# EAGLE design Stairs_v5 (EAGLE 9.2.0)
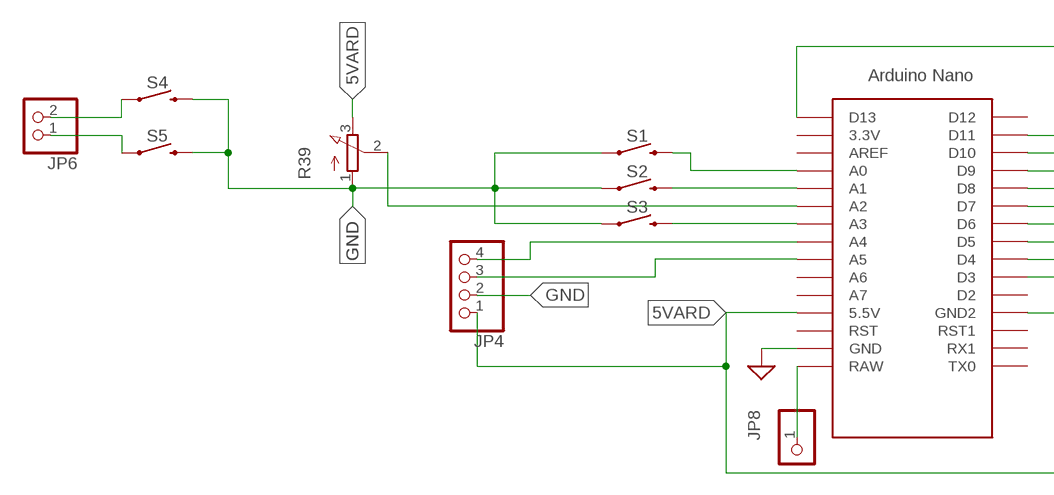
[diagram p0: schematic, sheet 1, part 1 of 2]
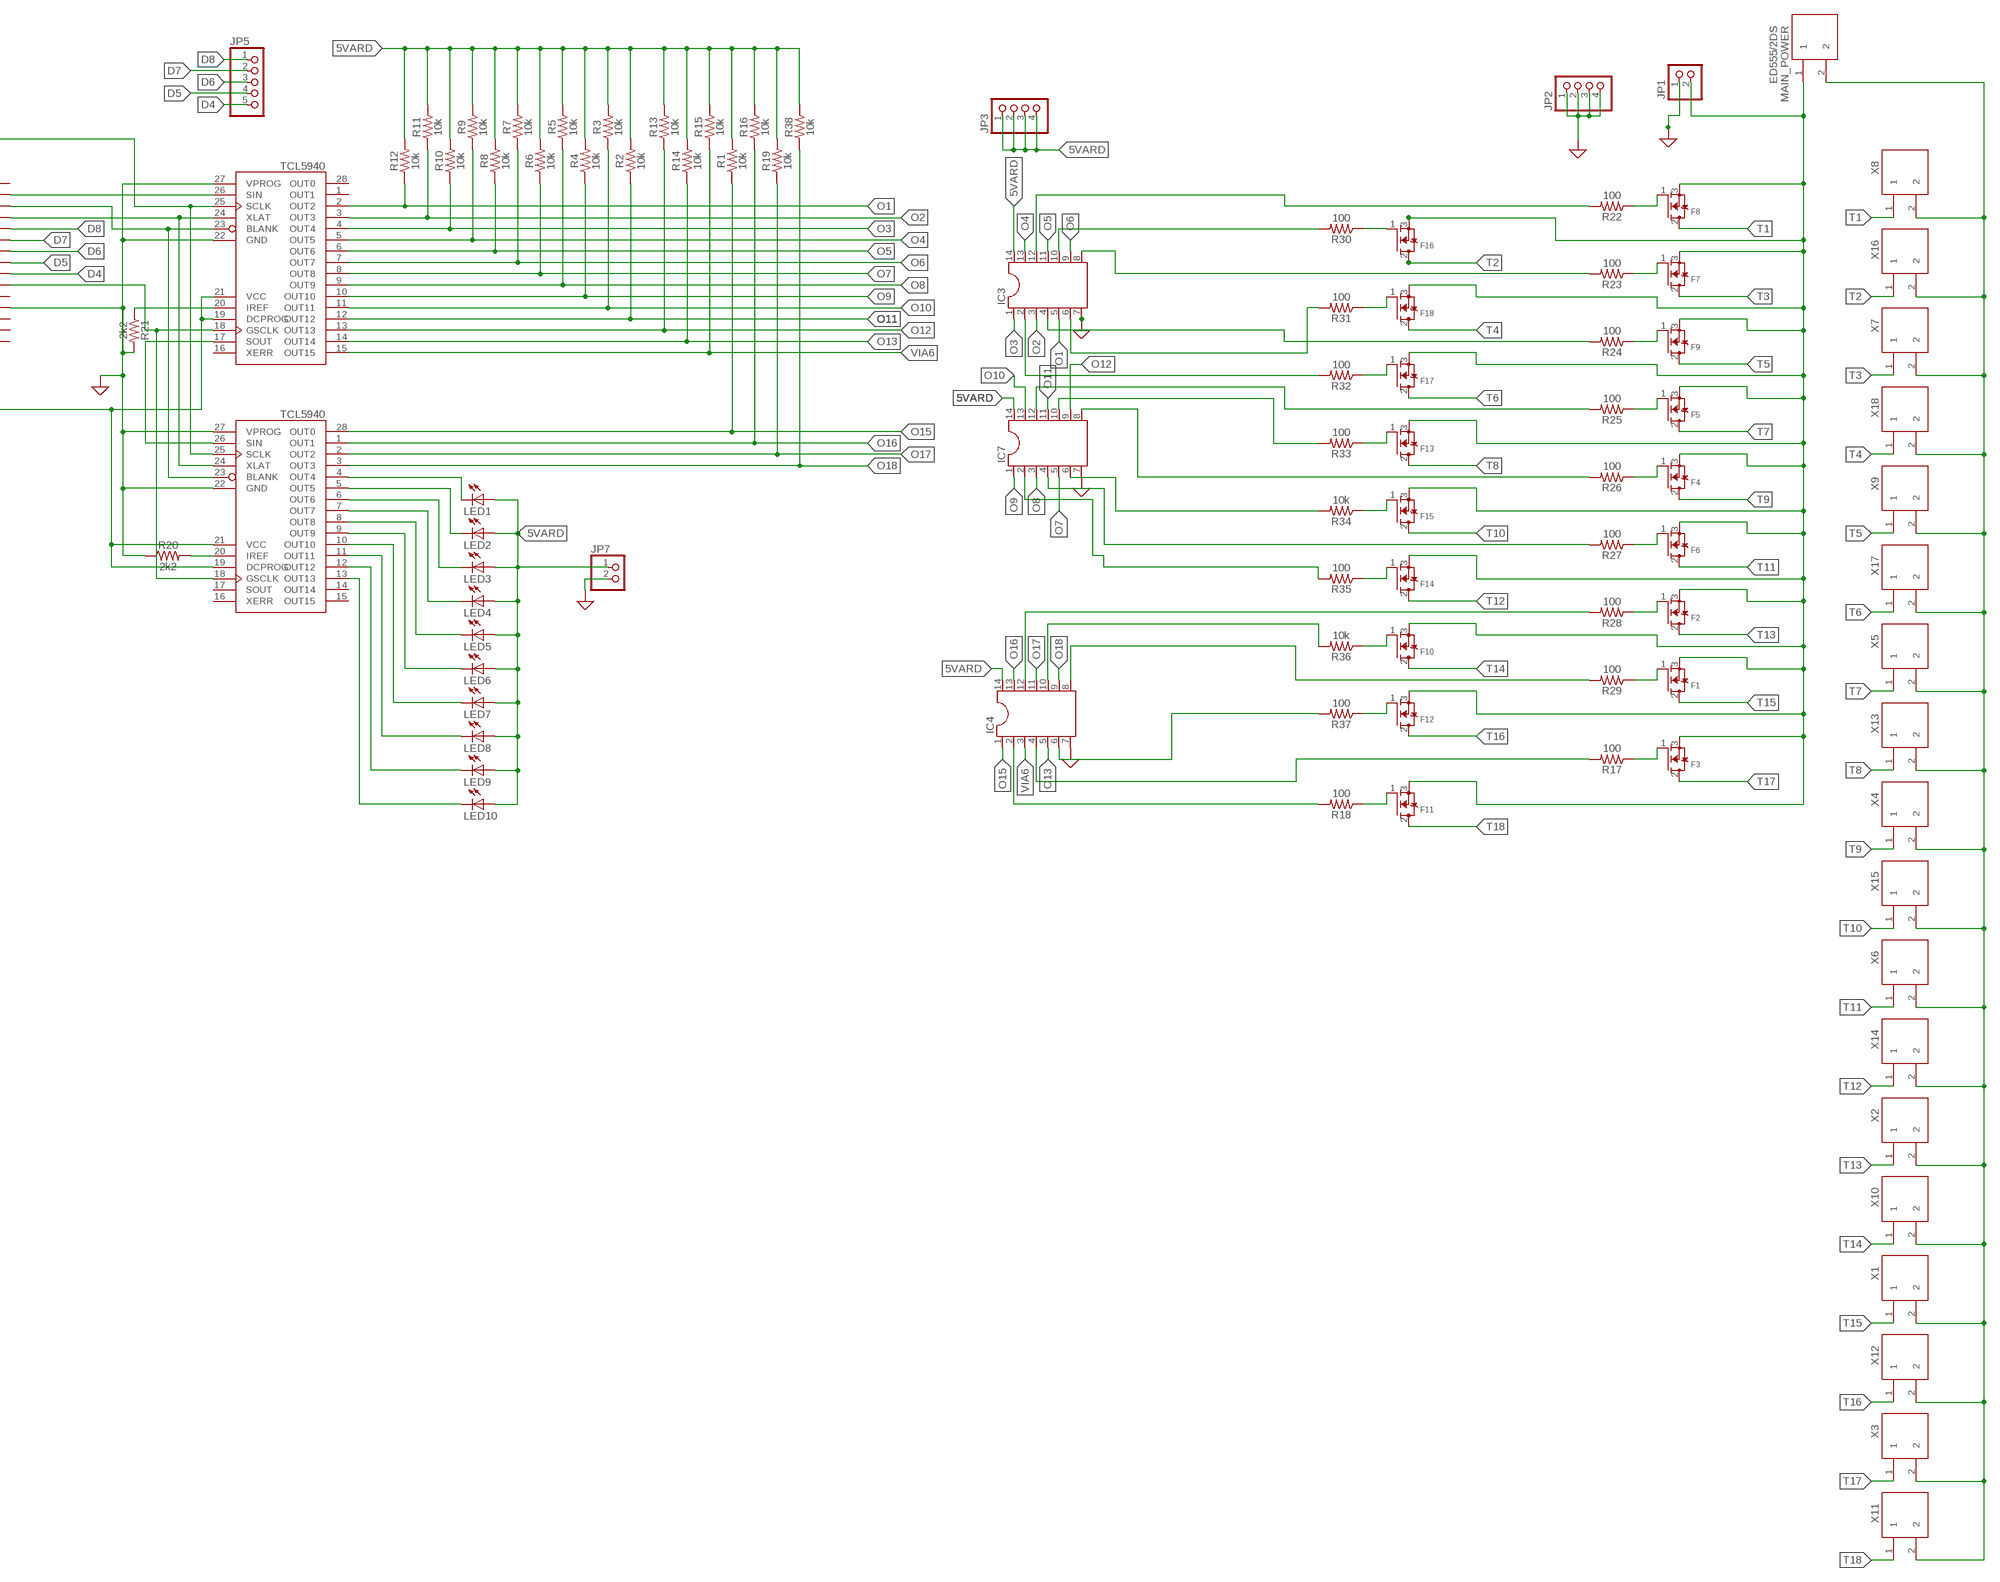
[diagram p1: schematic, sheet 1, part 2 of 2]

## Parts
F1  MOSFET-NGDS_TO220V  [TO220V]
F2  MOSFET-NGDS_TO220V  [TO220V]
F3  MOSFET-NGDS_TO220V  [TO220V]
F4  MOSFET-NGDS_TO220V  [TO220V]
F5  MOSFET-NGDS_TO220V  [TO220V]
F6  MOSFET-NGDS_TO220V  [TO220V]
F7  MOSFET-NGDS_TO220V  [TO220V]
F8  MOSFET-NGDS_TO220V  [TO220V]
F9  MOSFET-NGDS_TO220V  [TO220V]
F10  MOSFET-NGDS_TO220V  [TO220V]
F11  MOSFET-NGDS_TO220V  [TO220V]
F12  MOSFET-NGDS_TO220V  [TO220V]
F13  MOSFET-NGDS_TO220V  [TO220V]
F14  MOSFET-NGDS_TO220V  [TO220V]
F15  MOSFET-NGDS_TO220V  [TO220V]
F16  MOSFET-NGDS_TO220V  [TO220V]
F17  MOSFET-NGDS_TO220V  [TO220V]
F18  MOSFET-NGDS_TO220V  [TO220V]
IC1  TCL5940  [DIP28]
IC2  TCL5940  [DIP28]
IC3  DIL14S  [SOCKET-14]
IC4  DIL14S  [SOCKET-14]
IC7  DIL14S  [SOCKET-14]
JP1  PINHD-1X2  [1X02]
JP2  PINHD-1X4  [1X04]
JP3  PINHD-1X4  [1X04]
JP4  PINHD-1X4  [1X04]
JP5  PINHD-1X5  [1X05]
JP6  PINHD-1X2  [1X02]
JP7  PINHD-1X2  [1X02]
JP8  PINHD-1X1  [1X01]
LED1  LEDSFH482  [SFH482]
LED2  LEDSFH482  [SFH482]
LED3  LEDSFH482  [SFH482]
LED4  LEDSFH482  [SFH482]
LED5  LEDSFH482  [SFH482]
LED6  LEDSFH482  [SFH482]
LED7  LEDSFH482  [SFH482]
LED8  LEDSFH482  [SFH482]
LED9  LEDSFH482  [SFH482]
LED10  LEDSFH482  [SFH482]
MAIN_POWER  ED555/2DS  [ED555/2DS]
R1  10k  10KOHM-HORIZ_KIT-1/4W-1%  [AXIAL-0.3-KIT]
R2  10k  10KOHM-HORIZ_KIT-1/4W-1%  [AXIAL-0.3-KIT]
R3  10k  10KOHM-HORIZ_KIT-1/4W-1%  [AXIAL-0.3-KIT]
R4  10k  10KOHM-HORIZ_KIT-1/4W-1%  [AXIAL-0.3-KIT]
R5  10k  10KOHM-HORIZ_KIT-1/4W-1%  [AXIAL-0.3-KIT]
R6  10k  10KOHM-HORIZ_KIT-1/4W-1%  [AXIAL-0.3-KIT]
R7  10k  10KOHM-HORIZ_KIT-1/4W-1%  [AXIAL-0.3-KIT]
R8  10k  10KOHM-HORIZ_KIT-1/4W-1%  [AXIAL-0.3-KIT]
R9  10k  10KOHM-HORIZ_KIT-1/4W-1%  [AXIAL-0.3-KIT]
R10  10k  10KOHM-HORIZ_KIT-1/4W-1%  [AXIAL-0.3-KIT]
R11  10k  10KOHM-HORIZ_KIT-1/4W-1%  [AXIAL-0.3-KIT]
R12  10k  10KOHM-HORIZ_KIT-1/4W-1%  [AXIAL-0.3-KIT]
R13  10k  10KOHM-HORIZ_KIT-1/4W-1%  [AXIAL-0.3-KIT]
R14  10k  10KOHM-HORIZ_KIT-1/4W-1%  [AXIAL-0.3-KIT]
R15  10k  10KOHM-HORIZ_KIT-1/4W-1%  [AXIAL-0.3-KIT]
R16  10k  10KOHM-HORIZ_KIT-1/4W-1%  [AXIAL-0.3-KIT]
R17  100  10KOHM-HORIZ_KIT-1/4W-1%  [AXIAL-0.3-KIT]
R18  100  10KOHM-HORIZ_KIT-1/4W-1%  [AXIAL-0.3-KIT]
R19  10k  10KOHM-HORIZ_KIT-1/4W-1%  [AXIAL-0.3-KIT]
R20  2k2  10KOHM-HORIZ_KIT-1/4W-1%  [AXIAL-0.3-KIT]
R21  2k2  10KOHM-HORIZ_KIT-1/4W-1%  [AXIAL-0.3-KIT]
R22  100  10KOHM-HORIZ_KIT-1/4W-1%  [AXIAL-0.3-KIT]
R23  100  10KOHM-HORIZ_KIT-1/4W-1%  [AXIAL-0.3-KIT]
R24  100  10KOHM-HORIZ_KIT-1/4W-1%  [AXIAL-0.3-KIT]
R25  100  10KOHM-HORIZ_KIT-1/4W-1%  [AXIAL-0.3-KIT]
R26  100  10KOHM-HORIZ_KIT-1/4W-1%  [AXIAL-0.3-KIT]
R27  100  10KOHM-HORIZ_KIT-1/4W-1%  [AXIAL-0.3-KIT]
R28  100  10KOHM-HORIZ_KIT-1/4W-1%  [AXIAL-0.3-KIT]
R29  100  10KOHM-HORIZ_KIT-1/4W-1%  [AXIAL-0.3-KIT]
R30  100  10KOHM-HORIZ_KIT-1/4W-1%  [AXIAL-0.3-KIT]
R31  100  10KOHM-HORIZ_KIT-1/4W-1%  [AXIAL-0.3-KIT]
R32  100  10KOHM-HORIZ_KIT-1/4W-1%  [AXIAL-0.3-KIT]
R33  100  10KOHM-HORIZ_KIT-1/4W-1%  [AXIAL-0.3-KIT]
R34  10k  10KOHM-HORIZ_KIT-1/4W-1%  [AXIAL-0.3-KIT]
R35  100  10KOHM-HORIZ_KIT-1/4W-1%  [AXIAL-0.3-KIT]
R36  10k  10KOHM-HORIZ_KIT-1/4W-1%  [AXIAL-0.3-KIT]
R37  100  10KOHM-HORIZ_KIT-1/4W-1%  [AXIAL-0.3-KIT]
R38  10k  10KOHM-HORIZ_KIT-1/4W-1%  [AXIAL-0.3-KIT]
R39  3RP/1610N  [3RP/1610N]
S1  MOMENTARY-SWITCH-SPST-PTH-6.0MM  [TACTILE_SWITCH_PTH_6.0MM]
S2  MOMENTARY-SWITCH-SPST-PTH-6.0MM  [TACTILE_SWITCH_PTH_6.0MM]
S3  MOMENTARY-SWITCH-SPST-PTH-6.0MM  [TACTILE_SWITCH_PTH_6.0MM]
S4  MOMENTARY-SWITCH-SPST-PTH-6.0MM  [TACTILE_SWITCH_PTH_6.0MM]
S5  MOMENTARY-SWITCH-SPST-PTH-6.0MM  [TACTILE_SWITCH_PTH_6.0MM]
U$1  NANO  [NANO]
X1  ED555/2DS  [ED555/2DS]
X2  ED555/2DS  [ED555/2DS]
X3  ED555/2DS  [ED555/2DS]
X4  ED555/2DS  [ED555/2DS]
X5  ED555/2DS  [ED555/2DS]
X6  ED555/2DS  [ED555/2DS]
X7  ED555/2DS  [ED555/2DS]
X8  ED555/2DS  [ED555/2DS]
X9  ED555/2DS  [ED555/2DS]
X10  ED555/2DS  [ED555/2DS]
X11  ED555/2DS  [ED555/2DS]
X12  ED555/2DS  [ED555/2DS]
X13  ED555/2DS  [ED555/2DS]
X14  ED555/2DS  [ED555/2DS]
X15  ED555/2DS  [ED555/2DS]
X16  ED555/2DS  [ED555/2DS]
X17  ED555/2DS  [ED555/2DS]
X18  ED555/2DS  [ED555/2DS]

## Nets
5VARD: IC1.19(DCPROG) IC1.21(VCC) IC2.19(DCPROG) IC2.21(VCC) IC3.14 IC4.14 IC7.14 JP3.1 JP3.2 JP3.3 JP3.4 JP4.1 JP7.1 LED1.A LED2.A LED3.A LED4.A LED5.A LED6.A LED7.A LED8.A LED9.A LED10.A R1.P$2 R2.P$2 R3.P$2 R4.P$2 R5.P$2 R6.P$2 R7.P$2 R8.P$2 R9.P$2 R10.P$2 R11.P$2 R12.P$2 R13.P$2 R14.P$2 R15.P$2 R16.P$2 R19.P$2 R38.P$2 R39.3(E) U$1.5V(5.5V)
D4: JP5.5 U$1.D4
D5: JP5.4 U$1.D5
D6: JP5.3 U$1.D6
D7: JP5.2 U$1.D7
D8: JP5.1 U$1.D8
GND: IC1.22(GND) IC1.27(VPROG) IC2.22(GND) IC2.27(VPROG) IC3.7 IC4.7 IC7.7 JP1.1 JP2.1 JP2.2 JP2.3 JP2.4 JP4.2 JP7.2 R20.P$1 R21.P$2 R39.1(A) S1.1 S2.1 S3.1 S4.3 S5.3 U$1.GND U$1.GND1(GND2) ; supply symbol labelled SUP
N$1: IC2.4(OUT4) LED1.K(C)
N$2: JP8.1 U$1.RAW
N$3: IC1.25(SCLK) IC2.25(SCLK) U$1.D13
N$4: IC1.24(XLAT) IC2.24(XLAT) U$1.D9
N$5: IC2.5(OUT5) LED2.K(C)
N$6: JP6.2 S4.1
N$7: S1.3 U$1.A0
N$8: IC1.17(SOUT) IC2.26(SIN)
N$9: IC1.20(IREF) R21.P$1
N$10: IC2.20(IREF) R20.P$2
N$11: F7.1(G) R23.P$1
N$12: IC1.18(GSCLK) IC2.18(GSCLK) U$1.D3
N$13: S2.3 U$1.A1
N$14: R39.2(S) U$1.A2
N$15: F9.1(G) R24.P$1
N$16: S3.3 U$1.A3
N$17: JP4.4 U$1.A4
N$18: F5.1(G) R25.P$1
N$19: JP4.3 U$1.A5
N$21: F4.1(G) R26.P$1
N$22: JP6.1 S5.1
N$23: F8.1(G) R22.P$1
N$24: IC2.6(OUT6) LED3.K(C)
N$25: F6.1(G) R27.P$1
N$26: IC2.7(OUT7) LED4.K(C)
N$27: IC2.8(OUT8) LED5.K(C)
N$28: F2.1(G) R28.P$1
N$29: IC2.9(OUT9) LED6.K(C)
N$30: IC2.10(OUT10) LED7.K(C)
N$31: F1.1(G) R29.P$1
N$32: IC2.11(OUT11) LED8.K(C)
N$33: IC2.12(OUT12) LED9.K(C)
N$34: IC2.13(OUT13) LED10.K(C)
N$35: F16.1(G) R30.P$1
N$38: F18.1(G) R31.P$1
N$41: F17.1(G) R32.P$1
N$44: F13.1(G) R33.P$1
N$47: F15.1(G) R34.P$1
N$50: F14.1(G) R35.P$1
N$53: F10.1(G) R36.P$1
N$56: F12.1(G) R37.P$1
N$59: IC3.12 R22.P$2
N$60: IC3.8 R23.P$2
N$61: IC3.4 R24.P$2
N$79: IC7.10 R33.P$2
N$80: IC3.10 R30.P$2
N$81: IC3.6 R31.P$2
N$82: IC3.2 R32.P$2
N$83: IC7.12 R25.P$2
N$84: IC7.8 R26.P$2
N$85: IC7.4 R27.P$2
N$86: IC4.12 R28.P$2
N$87: IC4.8 R29.P$2
N$88: IC7.6 R34.P$2
N$89: IC4.10 R36.P$2
N$90: IC7.2 R35.P$2
N$91: IC4.6 R37.P$2
N$92: F3.1(G) R17.P$1
N$95: IC4.4 R17.P$2
N$96: F11.1(G) R18.P$1
N$99: IC4.2 R18.P$2
O1: IC1.2(OUT2) IC3.5 R12.P$1
O2: IC1.3(OUT3) IC3.3 R11.P$1
O3: IC1.4(OUT4) IC3.1 R10.P$1
O4: IC1.5(OUT5) IC3.13 R9.P$1
O5: IC1.6(OUT6) IC3.11 R8.P$1
O6: IC1.7(OUT7) IC3.9 R7.P$1
O7: IC1.8(OUT8) IC7.5 R6.P$1
O8: IC1.9(OUT9) IC7.3 R5.P$1
O9: IC1.10(OUT10) IC7.1 R4.P$1
O10: IC1.11(OUT11) IC7.13 R3.P$1
O11: IC1.12(OUT12) IC7.11 R2.P$1
O12: IC1.13(OUT13) IC7.9 R13.P$1
O13: IC1.14(OUT14) IC4.5 R14.P$1
O15: IC2.28(OUT0) IC4.1 R1.P$1
O16: IC2.1(OUT1) IC4.13 R16.P$1
O17: IC2.2(OUT2) IC4.11 R19.P$1
O18: IC2.3(OUT3) IC4.9 R38.P$1
POWER+: MAIN_POWER.2 X1.2 X2.2 X3.2 X4.2 X5.2 X6.2 X7.2 X8.2 X9.2 X10.2 X11.2 X12.2 X13.2 X14.2 X15.2 X16.2 X17.2 X18.2
POWER-: F1.3(S) F2.3(S) F3.3(S) F4.3(S) F5.3(S) F6.3(S) F7.3(S) F8.3(S) F9.3(S) F10.3(S) F11.3(S) F12.3(S) F13.3(S) F14.3(S) F15.3(S) F16.3(S) F17.3(S) F18.3(S) JP1.2 MAIN_POWER.1
T1: F8.2(D) X8.1
T2: F16.2(D) X16.1
T3: F7.2(D) X7.1
T4: F18.2(D) X18.1
T5: F9.2(D) X9.1
T6: F17.2(D) X17.1
T7: F5.2(D) X5.1
T8: F13.2(D) X13.1
T9: F4.2(D) X4.1
T10: F15.2(D) X15.1
T11: F6.2(D) X6.1
T12: F14.2(D) X14.1
T13: F2.2(D) X2.1
T14: F10.2(D) X10.1
T15: F1.2(D) X1.1
T16: F12.2(D) X12.1
T17: F3.2(D) X3.1
T18: F11.2(D) X11.1
VIA4: IC1.26(SIN) U$1.D11
VIA6: IC1.15(OUT15) IC4.3 R15.P$1
VIAXX: IC1.23(BLANK) IC2.23(BLANK) U$1.D10
Unconnected: IC1.1(OUT1) IC1.16(XERR) IC1.28(OUT0) IC2.14(OUT14) IC2.15(OUT15) IC2.16(XERR) IC2.17(SOUT) U$1.3.3V U$1.A6 U$1.A7 U$1.AREF U$1.D2 U$1.D12 U$1.ICSP1 U$1.ICSP2 U$1.ICSP3 U$1.ICSP4 U$1.ICSP5 U$1.ICSP6 U$1.RST U$1.RST1 U$1.RX1 U$1.TX0

## Library data of the parts
F1-F18 = adafruit:MOSFET-N: N-Channel Mosfet 2N7002E - 60V 260mA SOT23 [Digikey: 2N7002ET1GOSTR-ND] - REEL BSH103 - 30V 850mA SOT23 [Digikey: 568-5013-1-ND]
IC1 IC2 = tcl5940:TCL5940: 16-Channel 12-Bit LED Driver
IC3 IC4 IC7 = ic-package:DIL14: Dual In Line / Socket
JP1 JP6 JP7 = pinhead:PINHD-1X2: PIN HEADER
JP2-JP4 = pinhead:PINHD-1X4: PIN HEADER
JP5 = pinhead:PINHD-1X5: PIN HEADER
JP8 = pinhead:PINHD-1X1: PIN HEADER
LED1-LED10 = adafruit:LED: LED OSRAM: - CHIPLED LG R971, LG N971, LY N971, LG Q971, LY Q971, LO R971, LY R971 LH N974, LH R974 LS Q976, LO Q976, LY Q976 LO Q996 - Hyper CHIPLED LW Q18S LB Q993, LB Q99A, LB R99A - SideLED LS A670, LO A670, LY A670, LG A670, LP A670 LB A673, LV A673, LT A673, LW A673 LH A674 LY A675 LS A676, LA A676, LO A676, LY A676, LW A676 LS A679, LY A679, LG A679 - Hyper Micro SIDELED® LS Y876, LA Y876, LO Y876, LY Y876 LT Y87S - SmartLED LW L88C, LW L88S LB L89C, LB L89S, LG L890 LS L89K, LO L89K, LY L89K LS L896, LA L896, LO L896, LY L896 - TOPLED LS T670, LO T670, LY T670, LG T670, LP T670 LSG T670, LSP T670, LSY T670, LOP T670, LYG T670 LG T671, LOG T671, LSG T671 LB T673, LV T673, LT T673, LW T673 LH T674 LS T676, LA T676, LO T676, LY T676, LB T676, LH T676, LSB T676, LW T676 LB T67C, LV T67C, LT T67C, LS T67K, LO T67K, LY T67K, LW E67C LS E67B, LA E67B, LO E67B, LY E67B, LB E67C, LV E67C, LT E67C LW T67C LS T679, LY T679, LG T679 LS T770, LO T770, LY T770, LG T770, LP T770 LB T773, LV T773, LT T773, LW T773 LH T774 LS E675, LA E675, LY E675, LS T675 LS T776, LA T776, LO T776, LY T776, LB T776 LHGB T686 LT T68C, LB T68C - Hyper Mini TOPLED® LB M676 - Mini TOPLED Santana® LG M470 LS M47K, LO M47K, LY M47K Source: http://www.osram.convergy.de/
MAIN_POWER X1-X18 = DC_LOAD_AU:ED555/2DS: 2-Pin Terminal Block 3.5mm pitch 6A
R1-R16 R19 R34 R36 R38 = SparkFun-Resistors:10KOHM: 10kΩ resistor A resistor is a passive two-terminal electrical component that implements electrical resistance as a circuit element. Resistors act to reduce current flow, and, at the same time, act to lower voltage levels within circuits. - Wikipedia; PROD_ID: RES-12183
R17 R18 R20-R33 R35 R37 = SparkFun-Resistors:10KOHM: 10kΩ resistor A resistor is a passive two-terminal electrical component that implements electrical resistance as a circuit element. Resistors act to reduce current flow, and, at the same time, act to lower voltage levels within circuits. - Wikipedia; PROD_ID: RES-12183; VALUE: 10k
R39 = pot:3RP/1610N: 16mm Potentiometer one level Source: http://www.alphapotentiometers.net/html/16mm_pot_2.html
S1-S5 = SparkFun-Switches:MOMENTARY-SWITCH-SPST: Momentary Switch (Pushbutton) - SPST Normally-open (NO) SPST momentary switches (buttons, pushbuttons). Variants PTH-12MM - 12mm square, through-hole Momentary Pushbutton Switch - 12mm Square <https://www.sparkfun.com/products/9190> (COM-09190) PTH-6.0MM, PTH-6.0MM-KIT - 6.0mm square, through-hole Mini Pushbutton Switch <https://www.sparkfun.com/products/97> (COM-00097) KIT package intended for soldering kit's - only one side of pads' copper is exposed. PTH-RIGHT-ANGLE-KIT - Right-angle, through-hole Right Angle Tactile Button <https://www.sparkfun.com/products/10791> - Used on SparkFun BigTime Watch Kit <https://www.sparkfun.com/products/11734> SMD-12MM - 12mm square, surface-mount Tactile Button - SMD (12mm) <https://www.sparkfun.com/products/12993> (COM-12993) Used on SparkFun PicoBoard <https://www.sparkfun.com/products/11888> SMD-4.5MM - 4.5mm Square Trackball Switch Used on SparkFun Blackberry Trackballer Breakout <https://www.sparkfun.com/products/13169> SMD-4.6MMX2.8MM - 4.60mm x 2.80mm, surface mount Used on SparkFun SAMD21 Mini Breakout <https://www.sparkfun.com/products/13664> SMD-5.2MM, SMD-5.2-REDUNDANT - 5.2mm square, surface-mount Mini Pushbutton Switch - SMD <https://www.sparkfun.com/products/8720> (COM-08720) Used on Arduino Pro Mini <https://www.sparkfun.com/products/11114> REDUNDANT package connects both switch circuits together SMD-6.0X3.5MM - 6.0 x 3.5mm, surface mount Momentary Reset Switch SMD <https://www.sparkfun.com/products/8229> (COM-08229) SMD-6.2MM-TALL - 6.2mm square, surface mount Tactile Button - SMD (6mm) <https://www.sparkfun.com/products/12992> Used on SparkFun Digital Sandbox <https://www.sparkfun.com/products/12651> SMD-RIGHT-ANGLE - Right-angle, surface mount Used on SparkFun Block for Intel® Edison - Arduino <https://www.sparkfun.com/products/13036>; PROD_ID: SWCH-08441; SF_SKU: COM-00097
U$1 = Arduino-clone:NANO: Arduino Nano

## Net classes
0 default: width 0.3 mm, clearance 0.5 mm

## Board
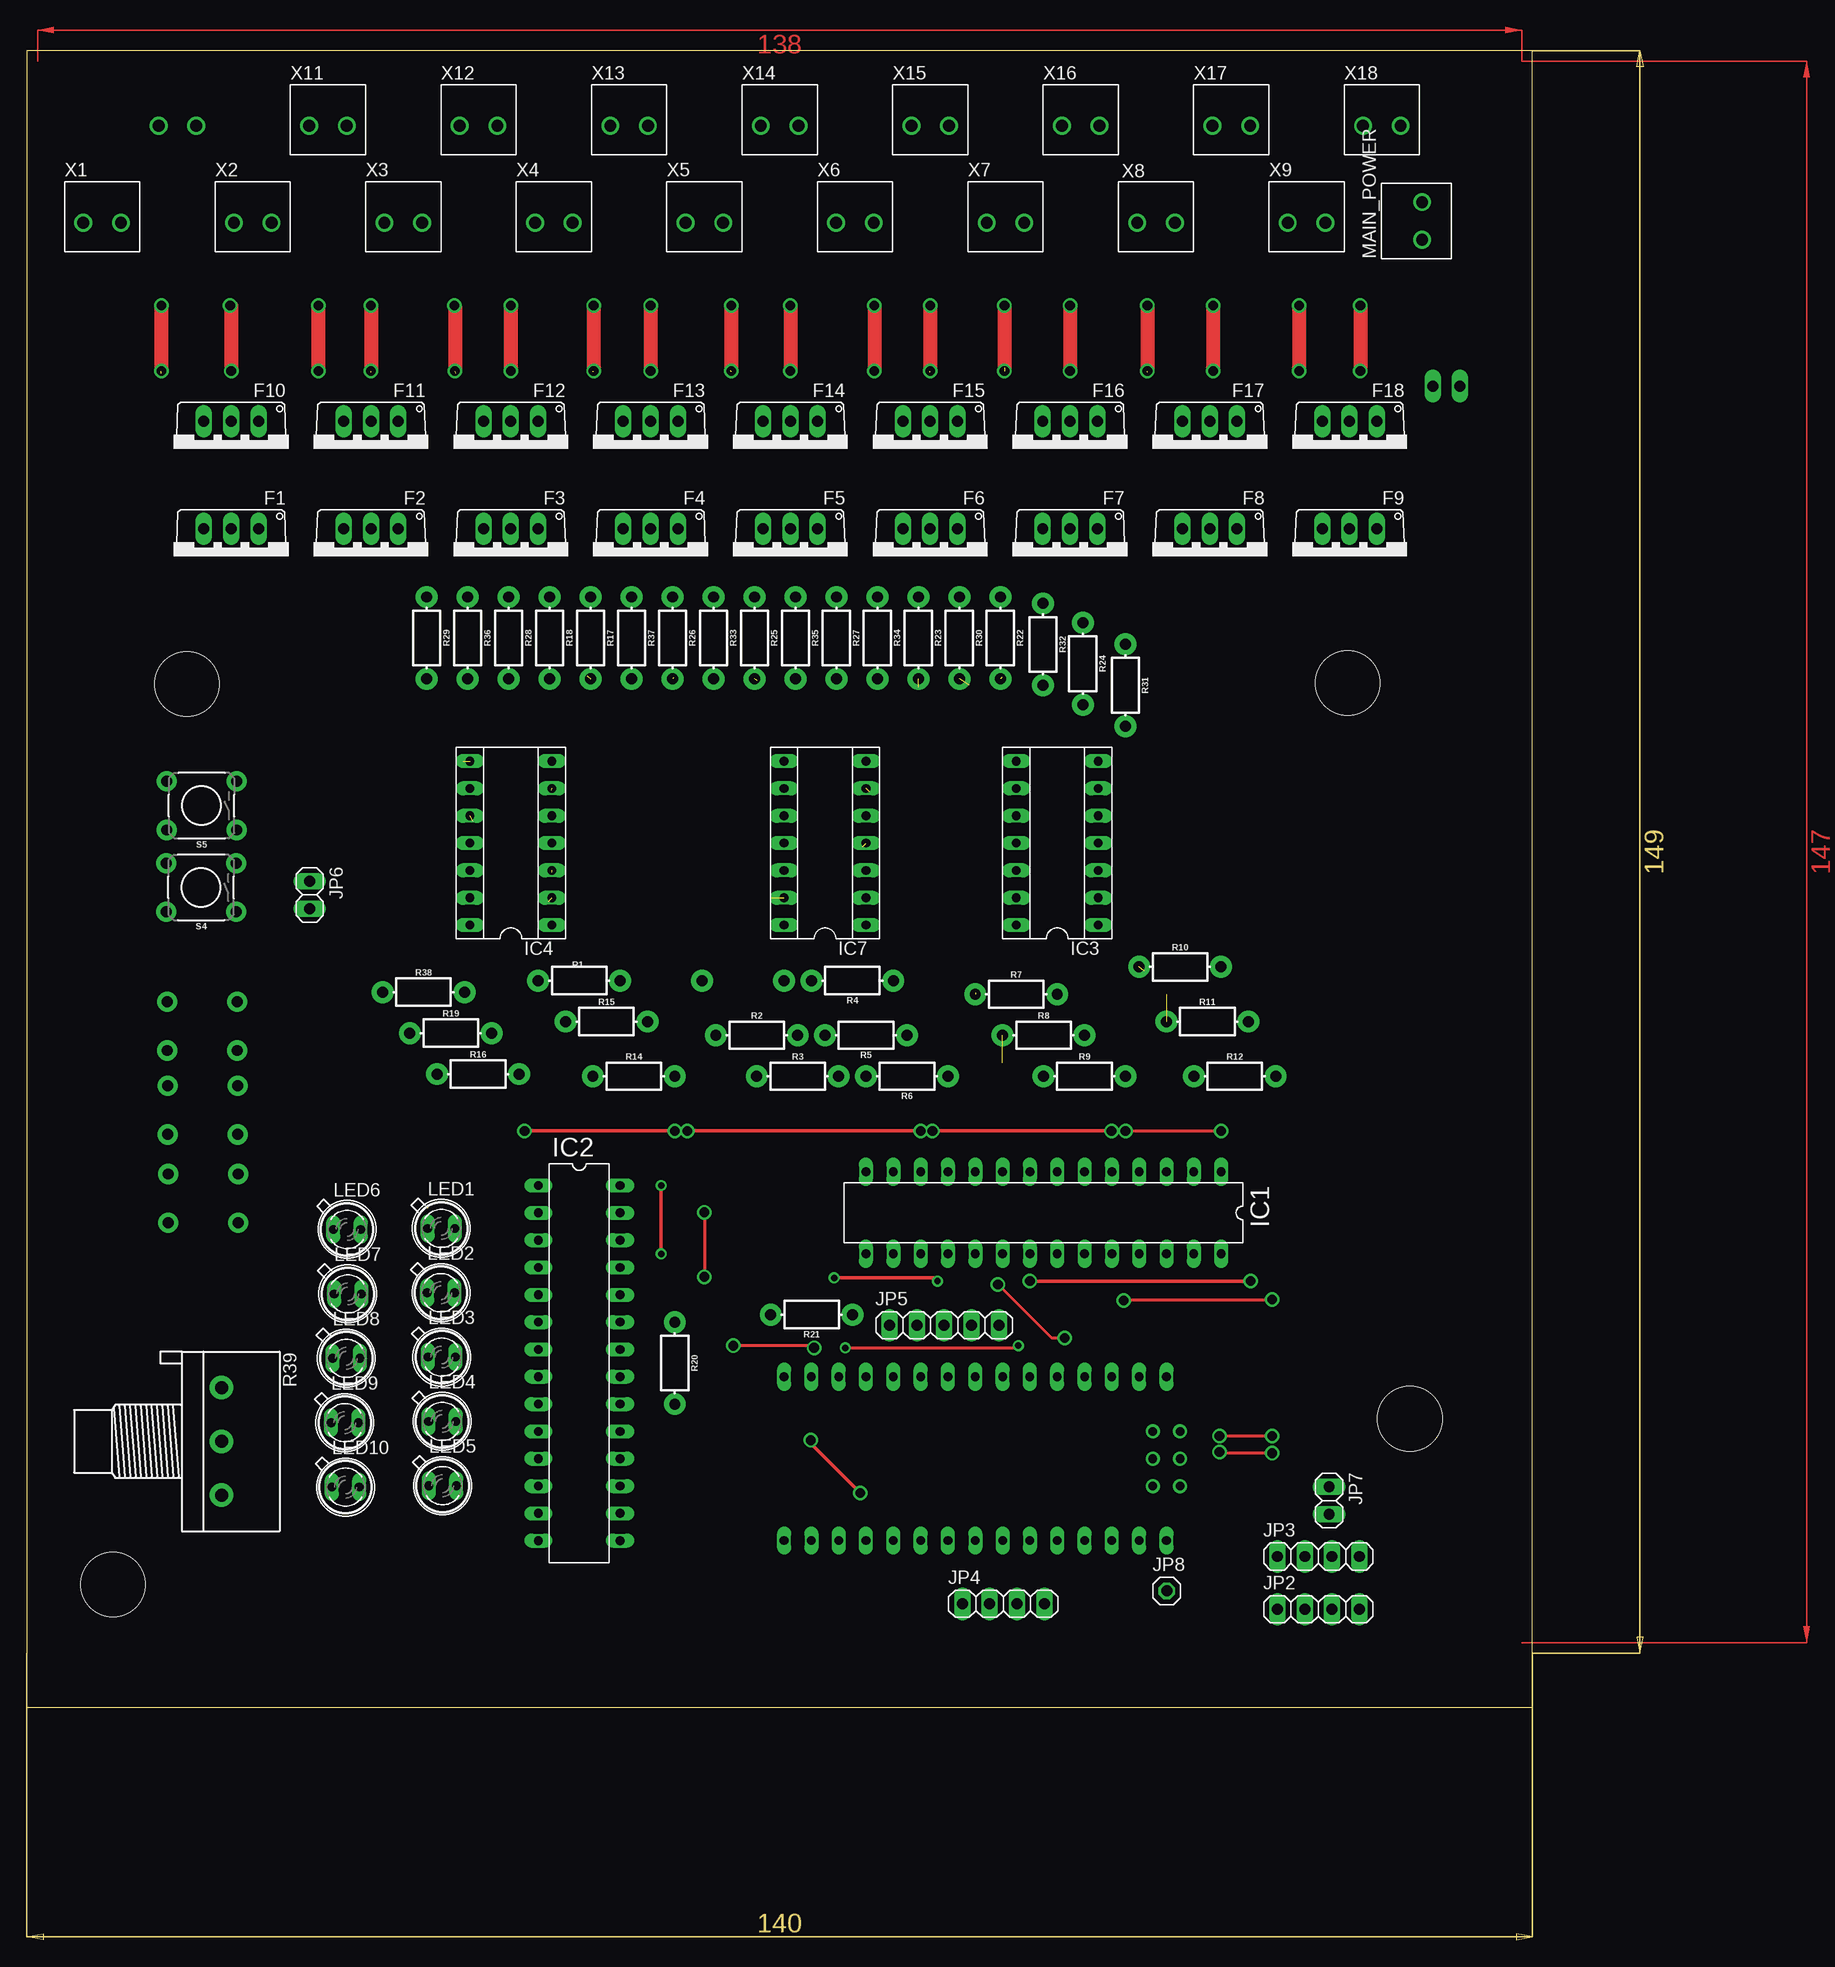
[diagram p2: board, top side]
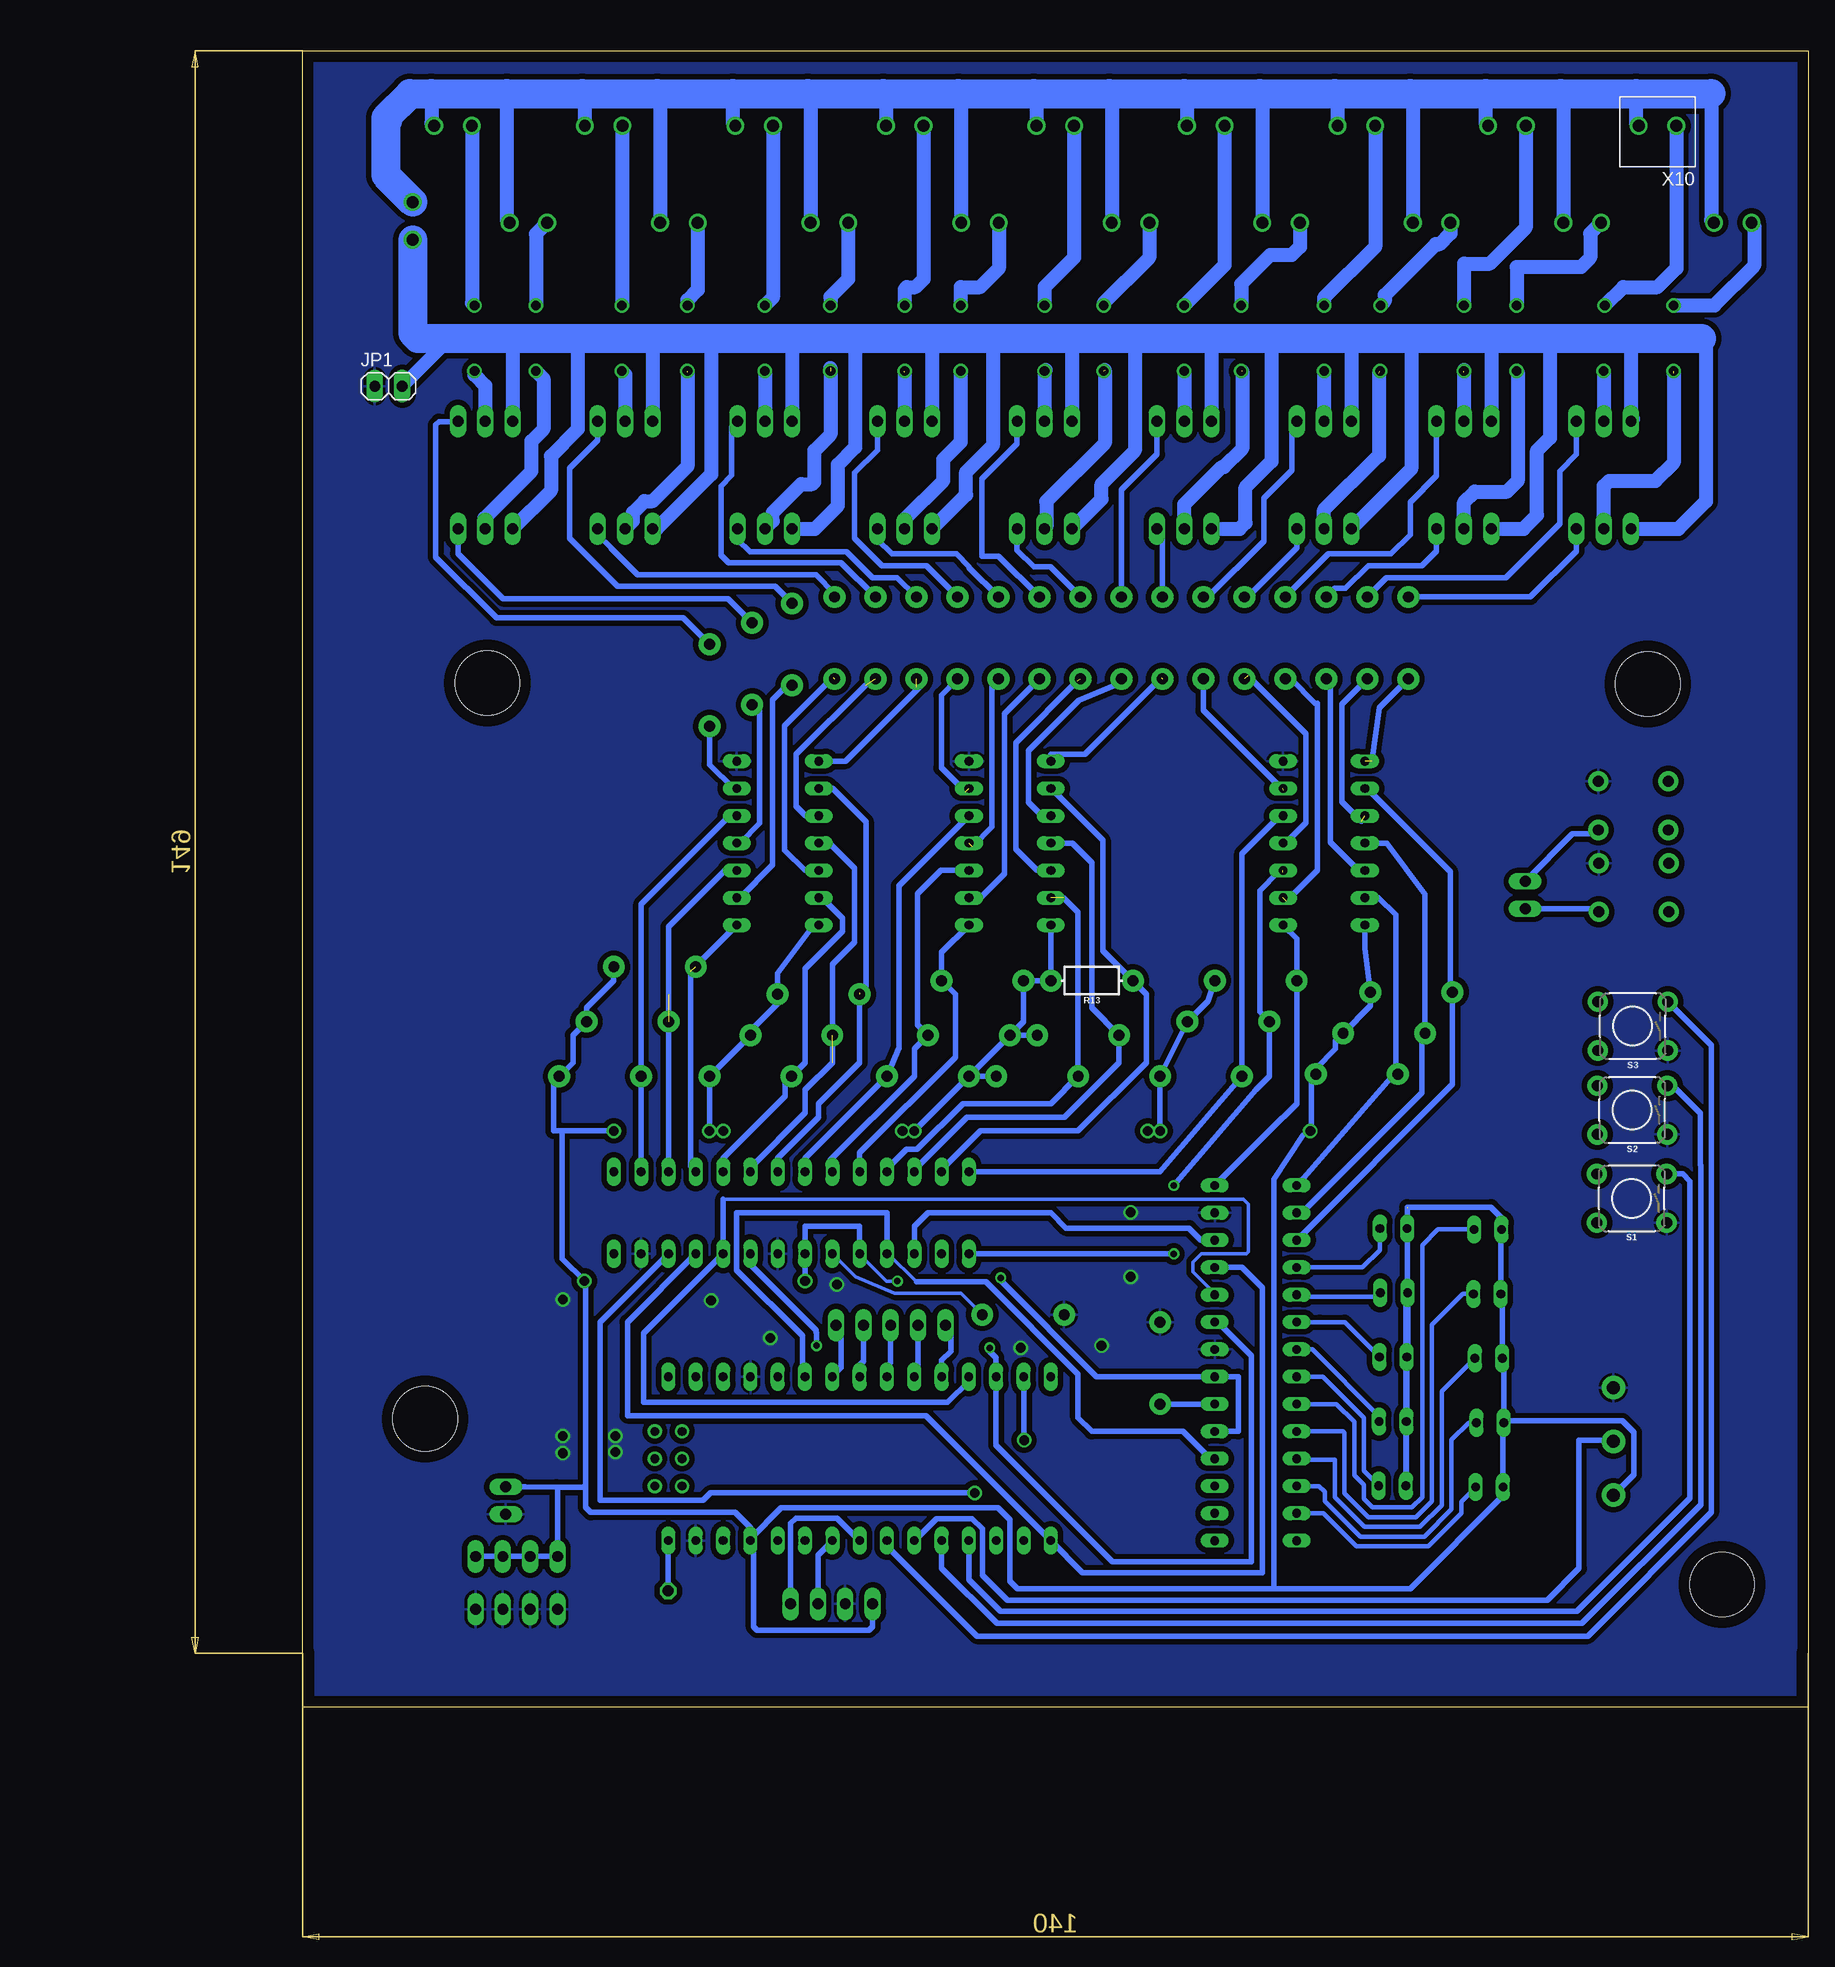
[diagram p3: board, bottom side, seen from below]

Size 140 x 154 mm. Coordinates in mm from the lower left corner, seen from the top.
Outline: 0,0 140,0
Outline: 140,5 140,154 0,154 0,5
Copper layers (1*16): Top 0.035mm / dielectric 1.5mm / Bottom 0.035mm
Design rules "default *": minimum track width 6mil, minimum drill 0.35mm, track to track 0.4mm, track to pad 0.4mm, pad to pad 0.4mm, via to via 0.4mm, smd to smd 6mil, copper to edge 40mil, drill to drill 6mil, minimum pad ring 10mil, minimum via ring 8mil, stop-mask expansion 0.4mm, vias tented up to drill 0mil, thermal gap 10mil
Holes 6 mm at 14.9,95.1 122.8,95.2 128.6,26.8 8,11.4

### Footprints (pad centres in the part's own frame; a part is rotated, then mirrored left to right if it is on the bottom)
TO220V = drill 1.016 long: 1 -2.54,-2.54; 2 0,-2.54; 3 2.54,-2.54
DIP28 = drill 0.813 long: 1 -15.24,-3.81; 2 -12.7,-3.81; 3 -10.16,-3.81; 4 -7.62,-3.81; 5 -5.08,-3.81; 6 -2.54,-3.81; 7 0,-3.81; 8 2.54,-3.81; 9 5.08,-3.81; 10 7.62,-3.81; 11 10.16,-3.81; 12 12.7,-3.81; 13 15.24,-3.81; 14 17.78,-3.81; 15 17.78,3.81; 16 15.24,3.81; 17 12.7,3.81; 18 10.16,3.81; 19 7.62,3.81; 20 5.08,3.81; 21 2.54,3.81; 22 0,3.81; 23 -2.54,3.81; 24 -5.08,3.81; 25 -7.62,3.81; 26 -10.16,3.81; 27 -12.7,3.81; 28 -15.24,3.81
SOCKET-14 = drill 0.813 long: 1 -7.62,-3.81; 2 -5.08,-3.81; 3 -2.54,-3.81; 4 0,-3.81; 5 2.54,-3.81; 6 5.08,-3.81; 7 7.62,-3.81; 8 7.62,3.81; 9 5.08,3.81; 10 2.54,3.81; 11 0,3.81; 12 -2.54,3.81; 13 -5.08,3.81; 14 -7.62,3.81
1X02 = drill 1.016 long: 1 -1.27,0; 2 1.27,0
1X04 = drill 1.016 long: 1 -3.81,0; 2 -1.27,0; 3 1.27,0; 4 3.81,0
1X05 = drill 1.016 long: 1 -5.08,0; 2 -2.54,0; 3 0,0; 4 2.54,0; 5 5.08,0
1X01 = drill 1.016 octagon: 1 0,0
SFH482 = drill 0.813 long: A -1.27,0; K 1.27,0
ED555/2DS = drill 1.1: 1 -1.75,0; 2 1.75,0
AXIAL-0.3-KIT = drill 1.016 pad 2.032: P$1 -3.81,0; P$2 3.81,0
3RP/1610N = drill 1.2 pad 2.184: 1 -5,0; 2 0,0; 3 5,0
TACTILE_SWITCH_PTH_6.0MM = drill 1.016 pad 1.88: 1 -3.251,2.261; 2 3.251,2.261; 3 -3.251,-2.261; 4 3.251,-2.261
NANO = drill 0.8 long: 3.3V -10.16,24.13; 5V -10.16,-1.27; A0 -10.16,19.05; A1 -10.16,16.51; A2 -10.16,13.97; A3 -10.16,11.43; A4 -10.16,8.89; A5 -10.16,6.35; A6 -10.16,3.81; A7 -10.16,1.27; AREF -10.16,21.59; D2 5.08,1.27; D3 5.08,3.81; D4 5.08,6.35; D5 5.08,8.89; D6 5.08,11.43; D7 5.08,13.97; D8 5.08,16.51; D9 5.08,19.05; D10 5.08,21.59; D11 5.08,24.13; D12 5.08,26.67; D13 -10.16,26.67; GND -10.16,-6.35; GND1 5.08,-1.27; RAW -10.16,-8.89; RST -10.16,-3.81; RST1 5.08,-3.81; RX1 5.08,-6.35; TX0 5.08,-8.89 | drill 0.8: ICSP1 -5.08,-10.16; ICSP2 -5.08,-7.62; ICSP3 -2.54,-10.16; ICSP4 -2.54,-7.62; ICSP5 0,-10.16; ICSP6 0,-7.62

### Placement (x,y rotation side)
F1  19,107 180 top
F2  32,107 180 top
F3  45,107 180 top
F4  58,107 180 top
F5  71,107 180 top
F6  84,107 180 top
F7  97,107 180 top
F8  110,107 180 top
F9  123,107 180 top
F10  19,117 180 top
F11  32,117 180 top
F12  45,117 180 top
F13  58,117 180 top
F14  71,117 180 top
F15  84,117 180 top
F16  97,117 180 top
F17  110,117 180 top
F18  123,117 180 top
IC1  95.81,45.95 180 top
IC2  51.36,33.25 270 top
IC3  95.81,80.32 90 top
IC4  45.01,80.32 90 top
IC7  74.22,80.32 90 top
JP1  132,122.8 0 bottom
JP2  120.1,9.1 0 top
JP3  120.1,14 0 top
JP4  90.8,9.6 0 top
JP5  85.3,35.5 0 top
JP6  26.3,75.5 270 top
JP7  121.1,19.2 270 top
JP8  106,10.8 0 top
LED1  38.54,44.5 0 top
LED2  38.5,38.52 0 top
LED3  38.58,32.54 0 top
LED4  38.62,26.56 0 top
LED5  38.66,20.58 0 top
LED6  29.77,44.4 0 top
LED7  29.84,38.41 0 top
LED8  29.7,32.42 0 top
LED9  29.56,26.44 0 top
LED10  29.63,20.45 0 top
MAIN_POWER  129.75,138.16 90 top
R1  51.36,67.54 0 top
R2  67.87,62.46 0 top
R3  71.68,58.65 0 top
R4  76.76,67.54 180 top
R5  78.03,62.46 180 top
R6  81.84,58.65 180 top
R7  92,66.27 0 top
R8  94.54,62.46 0 top
R9  98.35,58.65 0 top
R10  107.24,68.81 0 top
R11  109.78,63.73 0 top
R12  112.32,58.65 0 top
R13  66.6,67.54 180 bottom
R14  56.44,58.65 0 top
R15  53.9,63.73 0 top
R16  41.96,58.85 0 top
R17  52.42,99.39 270 top
R18  48.61,99.39 270 top
R19  39.42,62.66 0 top
R20  60.25,31.98 270 top
R21  72.98,36.49 180 top
R22  90.52,99.39 270 top
R23  82.9,99.39 270 top
R24  98.19,96.99 270 top
R25  67.66,99.39 270 top
R26  60.04,99.39 270 top
R27  75.28,99.39 270 top
R28  44.8,99.39 270 top
R29  37.18,99.39 270 top
R30  86.71,99.39 270 top
R31  102.15,94.99 270 top
R32  94.48,98.79 270 top
R33  63.85,99.39 270 top
R34  79.09,99.39 270 top
R35  71.47,99.39 270 top
R36  40.99,99.39 270 top
R37  56.23,99.39 270 top
R38  36.88,66.47 0 top
R39  18.1,24.7 270 top
S1  16.4,47.3 180 bottom
S2  16.35,55.5 180 bottom
S3  16.3,63.3 180 bottom
S4  16.2,76.2 180 top
S5  16.25,83.8 180 top
U$1  97.08,25.63 90 top
X1  7,138 0 top
X2  21,138 0 top
X3  35,138 0 top
X4  49,138 0 top
X5  63,138 0 top
X6  77,138 0 top
X7  91,138 0 top
X8  105,138 0 top
X9  119,138 0 top
X10  14,147 180 bottom
X11  28,147 0 top
X12  42,147 0 top
X13  56,147 0 top
X14  70,147 0 top
X15  84,147 0 top
X16  98,147 0 top
X17  112,147 0 top
X18  126,147 0 top

### Tracks (layer width: path | path; a pad name or v marks a point on that pad's centre or on a via)
5VARD  (via drill 0.6, 0.9, 0.9 pad 0.95)  (1 unrouted)
  Top 0.3: v102.16,53.57 v111.05,53.57
  Top 0.305: v113.79,39.6 v93.27,39.6 | v102.16,53.57 v83.11,53.57 v60.25,53.57 v46.28,53.57 | v84.68,39.6 84.38,39.9 v75.07,39.9
  Bottom 0.3: v102.16,53.57 v100.86,53.57 | v83.11,53.57 83.31,53.77 84.01,53.77 v84.21,53.57 | v61.41,53.57 v60.25,53.57 | 98.05,15.17 U$1.5V
  Bottom 0.305: 116.67,58.11 R12.P$2 | 113.79,39.65 v113.79,39.6 113.67,39.48 | R7.P$2 95.81,65.4 | 111.6,53.57 v111.05,53.57 | 92.48,72.7 IC3.14 | 45.77,59.35 R16.P$2 46.17,58.45 | 46.32,53.55 46.17,53.77 | 46.96,53.18 46.32,53.55 | 46.32,53.55 v46.28,53.57 | 74.2,11.7 73.39,10.89 | JP3.1 JP3.2 JP3.3 123.8,14 JP3.4 | LED4.A 37.09,26.3 | 28.13,26.6 LED9.A | v84.68,39.6 85.7,39.6 88.19,42.09 IC1.19 | U$1.5V 98.5,15.32 | 49.69,39.07 49.69,39.06 | 49.69,11.09 49.6,11.01
  Bottom 0.508: 113.79,39.65 115.84,41.7 115.84,53.57 | R12.P$2 114.86,59.92 114.86,62.46 R11.P$2 113.59,65 111.05,67.54 R10.P$2 | 95.81,65.4 98.35,62.86 R8.P$2 R9.P$2 v102.16,53.57 | 98.35,15.67 95.5,18.52 75.32,18.52 74.2,17.4 74.2,11.7 73.51,11.01 49.6,11.01 36.99,11.01 28.36,19.64 LED10.A 28.36,26.37 LED9.A 28.29,32.28 LED8.A 28.43,38.27 LED7.A 28.57,44.33 LED6.A 28.5,45.5 29.47,46.48 37.28,46.48 | 113.67,20.6 113.67,18.57 113.19,18.09 99.77,18.09 98.35,16.67 U$1.5V | 113.67,39.48 113.67,20.6 | v83.11,53.57 R6.P$2 | R6.P$2 R5.P$2 | R5.P$2 72.95,63.73 R4.P$2 R13.P$2 IC7.14 | R7.P$2 95.81,68.21 92.48,72.7 | R3.P$2 R6.P$2 | R5.P$2 R2.P$2 | v60.25,53.57 R14.P$2 R15.P$2 55.81,65.64 R1.P$2 | 45.77,59.35 43.93,61.19 43.93,61.96 R19.P$2 40.69,65.2 R38.P$2 41.2,70.55 IC4.14 | 46.96,53.18 49.69,49.09 49.69,39.07 | 46.17,58.45 46.17,53.77 | R39.3 16.2,21.6 16.2,25.55 17.25,26.6 28.13,26.6 | 37.39,37.64 LED5.A 37.35,20.62 LED4.A 37.31,26.6 LED3.A 37.23,32.62 LED2.A 37.27,38.56 LED1.A 37.27,46.37 | 119.3,20.47 JP7.1 116.4,20.44 | 116.4,20.44 113.84,20.43 113.67,20.6 | 116.4,20.44 116.29,20.34 JP3.1 123.8,14 | v75.07,39.9 75.07,39.63 66.15,30.71 IC2.21 52.98,30.71 52.98,25.63 IC2.19 | IC1.19 88.19,44.68 93.27,44.68 IC1.21 v93.27,39.6 | JP4.1 86.99,7.46 87.3,7.15 97.75,7.15 98.05,7.45 98.05,15.17 | 49.69,39.06 49.69,11.09 | 115.84,53.57 116.67,53.57 116.67,58.11 | 115.84,53.57 111.6,53.57
D4
  Bottom 0.508: U$1.D4 89.9,31.54 89.9,35.02 JP5.5
D5
  Bottom 0.3: U$1.D5
  Bottom 0.508: U$1.D5 88.2,31.8 87.84,32.16 JP5.4
D6
  Bottom 0.508: U$1.D6 85.65,31.65 85.3,32 JP5.3
D7
  Bottom 0.3: 82.76,31.06 U$1.D7
  Bottom 0.508: JP5.2 82.76,31.06
D8
  Bottom 0.508: U$1.D8 80.57,32.23 79.7,33.1 79.7,34.98 JP5.1
GND  (via drill 0.9 pad 0.95)
  Top 0.3: 90.2,39.3 v90.3,39.3 95.3,34.3 v96.5,34.3 | v115.8,25.2 v110.9,25.2 | v115.8,23.6 111,23.6 v110.9,23.7 | v73.2,33.4 73,33.6 v65.7,33.6 | v63,46 v63,40 | v115.8,37.9 115.7,37.8 v102,37.8
  pour Bottom: -37.54,176.5 224.56,176.5 224.56,-9.76 -37.54,-9.76
N$1
  Bottom 0.406: IC2.4 41.43,40.87 39.81,42.49 LED1.K
N$2
  Bottom 0.508: JP8.1 106,15.44 U$1.RAW
N$3
  Bottom 0.508: IC1.25 109.78,35.79 109.78,27.1 82.04,27.1 U$1.D13 67.45,12.51 50.74,12.51 50.74,38.98 52.63,40.87 IC2.25
N$4
  Bottom 0.305: IC2.24 55.17,38.45 57.2,40.47 57.2,41.37 56.43,42.14 52.22,42.14 52.04,42.31 52.04,46.75 52.52,47.22 100.89,47.22
  Bottom 0.508: U$1.D9 78.03,30.31 80.02,28.32 108.29,28.32 108.29,34.74 IC1.24 100.89,47.22
N$5
  Bottom 0.406: LED2.K 40.16,38.13 47.35,38.13 IC2.5
N$6
  Bottom 0.305: 19.74,74.23 S4.1
  Bottom 0.508: JP6.2 19.74,74.23
N$7
  Bottom 0.305: 75.6,9.4
  Bottom 0.508: U$1.A0 78.03,11.83 75.6,9.4 | 75.6,9.4 75.09,8.9 21.51,8.9 11,19.4 11,48.9 11.66,49.56 S1.3
N$8
  Bottom 0.508: IC1.17 83.11,44.68 81.84,45.95 70.41,45.95 68.99,44.53 57.56,44.53 56.44,43.41 IC2.26
N$9
  Bottom 0.305: IC1.20 88.58,40 84.95,38.49 78.79,38.49 R21.P$1
N$10
  Bottom 0.508: R20.P$2 IC2.20
N$11
  Bottom 0.305: 99.54,108.54 F7.1
  Bottom 0.508: R23.P$1 84.7,105 87,105 89.4,107.4 98.4,107.4 99.54,108.54
N$12
  Bottom 0.305: U$1.D3 93.52,30.96 | IC1.18 85.53,42.14 82.92,39.53
  Bottom 0.508: 93.52,30.96 93.52,34.52 99.62,40.62 99.62,45.95 85.65,45.95 IC1.18 | IC2.18 55.57,23.09 58.11,25.63 66.6,25.63 67.87,26.9 67.87,30.96 76.44,39.53 82.92,39.53
N$13
  Bottom 0.305: 9.99,50.39 10,50.4
  Bottom 0.508: U$1.A1 80.57,12.92 75.44,7.79 21.01,7.79 9.99,18.81 9.99,50.39 | 10,50.4 10,55.2 12.56,57.76 S2.3
N$14
  Bottom 0.305: 18.2,24.8 R39.2
  Bottom 0.508: U$1.A2 81.05,17.53 77.73,17.53 76.77,16.57 76.77,12.27 74.45,9.95 24.25,9.95 21.3,12.9 21.3,24.8 18.2,24.8
N$15
  Bottom 0.305: 98.94,100.8 R24.P$1
  Bottom 0.508: F9.1 125.54,107.24 121.35,103.05 100.44,103.05 R24.P$1
N$16
  Bottom 0.305: U$1.A3 85.65,14.95
  Bottom 0.508: 85.65,14.95 77.3,6.59 20.5,6.59 9,18.09 9,61.51 S3.3
N$17
  Bottom 0.508: JP4.4 94.61,17.09 94.12,17.58 90.3,17.58 U$1.A4
N$18
  Bottom 0.508: R25.P$1 70.46,106 72,106 73.54,107.54 F5.1
N$19
  Bottom 0.508: JP4.3 92.07,14.13 U$1.A5
N$21
  Bottom 0.508: R26.P$1 60.04,109.04 F4.1
N$22
  Bottom 0.305: 19.87,81.17 S5.1
  Bottom 0.508: JP6.1 21.9,81.17 19.87,81.17
N$23
  Bottom 0.305: R22.P$1 90.52,103.52 | 111.31,107.73 111.31,107.76
  Bottom 0.508: 90.52,103.52 92.25,105.25 108.83,105.25 111.31,107.73 | F8.1 112.54,108.99 111.31,107.76
N$24
  Bottom 0.406: IC2.6 45.41,35.79 43.09,35.79 LED3.K
N$25
  Bottom 0.305: 78,105.92 78,106
  Bottom 0.508: R27.P$1 78,105.92 | 78,106 79.2,107.2 85.2,107.2 86.54,108.54 F6.1
N$26
  Bottom 0.406: IC2.7 46.08,33.25 39.89,27.06 LED4.K
N$27
  Bottom 0.406: IC2.8 45.11,30.71 41.3,26.9 41.3,21.95 LED5.K
N$28
  Bottom 0.508: R28.P$1 44,104 43,104 40.9,106.1 35.9,106.1 34.54,107.46 F2.1
N$29
  Bottom 0.406: IC2.9 43.85,28.17 42.21,26.52 42.21,21.58 41.29,20.66 41.29,19.35 40.5,18.56 36.83,18.56 35.87,19.52 35.87,42.93 34.4,44.4 LED6.K
N$30
  Bottom 0.406: IC2.10 43.24,25.63 43.11,25.5 43.11,19.89 40.87,17.65 36.45,17.65 34.96,19.14 34.96,35.55 32.1,38.41 LED7.K
N$31
  Bottom 0.508: R29.P$1 25.8,103.2 21.54,107.46 F1.1
N$32
  Bottom 0.406: IC2.11 47.46,23 44.02,23 44.02,19.52 41.25,16.74 36.07,16.74 34.05,18.76 34.05,29.34 LED8.K
N$33
  Bottom 0.406: IC2.12 45.48,20.55 44.93,20 44.93,19.14 41.62,15.84 35.7,15.84 33.15,18.39 33.15,24.85 31.56,26.44 LED9.K
N$34
  Bottom 0.406: IC2.13 45.08,18.01 42,14.93 35.32,14.93 32.24,18.01 32.24,19.11 LED10.K
N$35
  Bottom 0.305: 100.1,118.98 F16.1
  Bottom 0.508: R30.P$1 89.91,106.4 100.4,106.4 101.1,107.1 101.1,113.5 100.1,114.5 100.1,118.98
N$38
  Bottom 0.305: 125.54,119.34 125.54,119.5 F18.1
  Bottom 0.508: R31.P$1 104.6,101.25 121.95,101.25 127.6,106.9 127.6,119.2 127.3,119.5 125.54,119.5
N$41
  Bottom 0.508: R32.P$1 96.08,104.2 110.7,104.2 115.15,108.65 115.15,115.15 112.54,117.76 F17.1
N$44
  Bottom 0.305: 64.2,103.55 R33.P$1
  Bottom 0.508: R33.P$1 63.85,113.15 60.54,116.46 F13.1
N$47
  Bottom 0.508: R34.P$1 81.99,106.1 86.1,106.1 88.65,108.65 88.65,114.75 86.54,116.86 F15.1
N$50
  Bottom 0.508: R35.P$1 75.27,107 76.8,107 76.8,114.2 73.54,117.46 F14.1
N$53
  Bottom 0.305: R36.P$1 40.29,103.9
  Bottom 0.508: R36.P$1 39.19,105 28.1,105 23.1,110 23.1,114.9 21.54,116.46 F10.1
N$56
  Bottom 0.305: R37.P$1 55.8,103.2 | 48,119.08 F12.1
  Bottom 0.508: 55.8,103.2 50.6,108.4 50.6,112.4 48,115 48,119.08
N$59  (1 unrouted)
  Bottom 0.305: 93.28,77.78 IC3.12
  Bottom 0.508: 93.28,77.78 95.15,79.65 95.15,91.24 90.66,95.72
N$60  (1 unrouted)
  Bottom 0.305: 82.92,94.83 82.61,94.83
  Bottom 0.508: IC3.8 89.5,87.94 82.61,94.83
N$61
  Bottom 0.508: IC3.4 99.32,80.32 97.49,82.15 97.49,92.84 97.84,93.18 R24.P$2
N$79
  Bottom 0.305: IC7.10 71.22,82.86
  Bottom 0.508: 71.22,82.86 72.49,84.13 72.49,88.89 67.78,93.6 64.45,94.98 R33.P$2
N$80  (1 unrouted)
  Bottom 0.508: IC3.10 93.21,82.86 94.09,83.74 94.09,88.56 87.64,95.01
N$81
  Bottom 0.305: IC3.6 99.93,85.4
  Bottom 0.508: 99.93,85.4 102.15,87.62 R31.P$2
N$82
  Bottom 0.305: R32.P$2 94.46,95 94.46,95.45 94.58,95.33
  Bottom 0.508: IC3.2 99.32,75.24 96.27,78.29 96.27,93.64 94.46,95.45
N$83  (1 unrouted)
  Bottom 0.305: 71.68,77.78 IC7.12
  Bottom 0.508: 71.68,77.78 73.65,79.75 73.65,89.67 67.92,95.39
N$84  (1 unrouted)
  Bottom 0.508: 60.13,95.67 67.23,88.58 70.41,88.58 IC7.8
N$85  (1 unrouted)
  Bottom 0.305: R27.P$2 75.89,94.97
  Bottom 0.508: 77.71,80 75.89,81.83 75.89,94.97
N$86
  Bottom 0.3: R28.P$2 44.77,95.58 44.58,95.39
  Bottom 0.305: 44.58,95.39 44.41,95.22
  Bottom 0.508: IC4.12 41.8,77.78 44.41,80.39 44.41,95.22
N$87  (1 unrouted)
  Bottom 0.508: 40.56,87.94 39.85,92.91 R29.P$2
N$88  (1 unrouted)
  Bottom 0.508: R34.P$2 80.59,94.08 80.59,87.33 78.35,85.08
N$89  (1 unrouted)
  Bottom 0.508: 41.52,82.34 43.34,84.16 43.34,93.23 R36.P$2
N$90
  Bottom 0.305: IC7.2 78.02,75.22 76.97,75.22
  Bottom 0.508: 76.97,75.22 74.72,77.48 74.72,92.33 R35.P$2
N$91  (1 unrouted)
  Bottom 0.508: R37.P$2 56.23,92.67 48.79,85.23
N$92
  Bottom 0.305: 52.72,103.5 R17.P$1 52.1,103.2
  Bottom 0.508: 52.1,103.2 47.54,107.76 F3.1
N$95  (1 unrouted)
  Bottom 0.305: IC4.4 48.61,80.32
  Bottom 0.508: 48.61,80.32 46.69,82.23 46.69,90.49 52.1,95.9
N$96
  Bottom 0.508: R18.P$1 44.61,107.2 38.8,107.2 37,109 37,112 34.54,114.46 F11.1
N$99  (1 unrouted)
  Bottom 0.305: R18.P$2 48.11,95.58
  Bottom 0.508: 48.5,74.92 45.63,77.8 45.63,93.33 45.86,93.33 48.11,95.58
O1
  Bottom 0.305: 100.29,82.86 IC3.5
  Bottom 0.508: IC1.2 R12.P$1 108.51,74.64 100.29,82.86
O2  (1 unrouted)
  Bottom 0.508: IC1.3 105.97,66.27 | IC3.3 100.72,77.78 105.97,72.53 R11.P$1
O3  (1 unrouted)
  Bottom 0.305: IC1.4 103.93,50.26
  Bottom 0.508: 103.93,50.26 103.93,68.39 IC3.1
O4
  Bottom 0.508: IC1.5 100.89,51.03 95.13,56.79 95.14,56.88 95.14,58.05 R9.P$1 93.27,59.92 93.27,68.65 89.8,72.12 89.8,73.34 91.7,75.24 IC3.13
O5  (1 unrouted)
  Bottom 0.508: IC3.11 91.1,80.32 91.03,80.25 90.95,80.25 88.69,77.99 88.69,71.09 90.73,69.05 90.73,59.92 93.27,57.38 93.27,55.24 98.35,50.16 IC1.6
O6  (1 unrouted)
  Bottom 0.3: 87.62,66.97 88.19,66.4
  Bottom 0.305: IC1.7 95.81,51.03
  Bottom 0.508: IC3.9 90.7,85.4 87.62,82.32 87.62,66.97 | 88.19,66.4 88.19,59.92 92,56.11 92,54.84 95.81,51.03
O7
  Bottom 0.305: IC1.8 93.27,51.03
  Bottom 0.508: 93.27,51.03 92,52.3 R6.P$1 84.55,61.31 84.55,76.34 IC7.5
O8
  Bottom 0.305: 90.93,50.83 90.93,49.96 IC1.9
  Bottom 0.508: IC7.3 80.62,77.78 82.81,75.59 82.81,63.43 R5.P$1 83.11,61.19 83.11,58.65 90.93,50.83
O9
  Bottom 0.508: IC7.1 80.57,70.16 R4.P$1 79.3,66.27 79.3,60.42 88.19,51.53 IC1.10
O10  (1 unrouted)
  Bottom 0.508: IC1.11 85.65,50.06 83.85,51.86 82.85,51.86 78.6,56.11 70.41,56.11 R3.P$1 67.87,73.87 69.24,75.24
O11
  Bottom 0.508: IC1.12 83.11,49.96 78.23,54.84 69.14,54.84 64.06,59.92 R2.P$1 66.6,65 66.6,78.5 68.42,80.32 IC7.11
O12
  Bottom 0.305: IC7.9
  Bottom 0.508: IC1.13 80.57,49.96 76.96,53.57 67.87,53.57 61.52,59.92 61.52,66.27 R13.P$1 65.57,70.32 65.57,80.57 IC7.9
O13
  Bottom 0.508: IC1.14 60.25,49.76 R14.P$1 52.63,79.35 49.12,82.86 IC4.5
O15
  Bottom 0.305: 50.09,53.57
  Bottom 0.508: IC4.1 47.55,71.43 R1.P$1 47.55,56.11 50.09,53.57 IC2.28
O16
  Bottom 0.305: IC2.1 47.19,48.85 | 38.15,59.27 R16.P$1 38.35,59.05
  Bottom 0.508: IC4.13 39.94,75.24 38.35,73.65 38.35,59.05 | 47.19,48.85 38.15,59.27
O17
  Bottom 0.305: 35.65,62.7 R19.P$1 35.91,62.36
  Bottom 0.508: IC4.11 39.17,80.32 35.65,75.58 35.65,62.7 | IC2.2 47.05,45.95 35.91,57.09 35.91,62.36
O18
  Bottom 0.3: IC4.9 41.1,85.5
  Bottom 0.305: 33.28,66.68 R38.P$1
  Bottom 0.508: 41.1,85.5 33.28,77.68 33.28,66.68 | IC2.3 33.07,57.89 R38.P$1
POWER+
  Bottom 0.3: 133.1,141.56 132.25,142.41
  Bottom 1.3: X18.2 128,147.25 128,150 | X9.2 121,138.25 121,150 | X8.2 106.75,149.75 107,150 | X7.2 92.75,149.75 93,150 | X15.2 85.75,149.75 86,150 | X6.2 78.75,149.75 79,150 | X14.2 71.75,149.75 72,150 | X5.2 64.75,149.75 65,150 | X13.2 57.75,149.75 58,150 | X4.2 50.75,149.75 51,150 | X12.2 43.75,149.75 44,150 | X3.2 36.75,149.75 37,150 | X11.2 30,147.25 30,150 | X2.2 22.75,149.75 23,150 | X10.2 16,147.25 16,150 | X1.2 9,138.25 9,150 | X16.2 100,147.25 100,150 | X17.2 113.75,149.75 114,150
  Bottom 2.7: 130.09,140.25 MAIN_POWER.2 132.25,142.41 132.25,147.75 | 132.25,147.75 132.05,147.55 | 132.25,147.75 130,150 128,150 121,150 114,150 107,150 100,150 93,150 86,150 79,150 72,150 65,150 58,150 51,150 44,150 37,150 30,150 23,150 16,150 9,150
POWER-
  Bottom 0.61: 127.25,127.25 127.25,126.28
  Bottom 1.27: JP1.2 127.25,126.28
  Bottom 1.3: 75.25,127.25 75.9,127.25 75.8,127.15 75.8,117.3 78.3,114.8 78.3,112.7 F6.3 | 16.25,119.75 F10.3 16.46,127.11 16.6,127.25 | F1.3 12.06,109.54 9.5,112.1 9.5,126.87 9.88,127.25 | F2.3 26.46,109.54 25.2,110.8 25.2,116.8 24,118 24,127.25 | F11.3 29.46,127.11 29.6,127.25 | F12.3 42.46,127.21 42.5,127.25 | F3.3 36.9,115.1 36.9,127.05 37.1,127.25 | F4.3 52.86,109.54 52.3,110.1 52.3,113.4 49.9,115.8 49.9,127.15 50,127.25 | F13.3 55.46,127.11 55.6,127.25 | F14.3 68.46,127.01 68.7,127.25 | F5.3 65.7,112.3 65.7,113.7 62.6,116.8 62.6,126.85 62.2,127.25 | F7.3 92.36,109.54 90.2,111.7 90.2,115.5 88.6,117.1 88.6,127.15 88.7,127.25 | F16.3 94.46,127.11 94.6,127.25 | F8.3 107.06,109.54 102,114.6 102,127.25 | F17.3 107.46,127.19 107.4,127.25 | F18.3 120.46,127.01 120.7,127.25 | F9.3 116.9,113.1 116.9,116.3 114.4,118.8 114.4,127.25 | F15.3 81.46,127.11 81.6,127.25
  Bottom 2.7: 9.88,127.25 16.6,127.25 24,127.25 29.6,127.25 37.1,127.25 42.5,127.25 50,127.25 55.6,127.25 62.2,127.25 68.7,127.25 75.9,127.25 81.6,127.25 88.7,127.25 94.6,127.25 102,127.25 107.4,127.25 114.4,127.25 120.7,127.25 127.25,127.25 129.25,127.25 129.75,127.75 MAIN_POWER.1
T1  (via drill 0.9)  (1 unrouted)
  Top 1.3: v104.2,130.3 v104.2,124.2
  Bottom 1.3: v104.2,130.3 104.2,130.8 103.25,131.75 X8.1 | F8.2 109.27,110.27 109.27,111.05 108.21,112.11 107.43,112.11 104.2,115.34 104.2,124.1
T2  (via drill 0.9)
  Top 1.3: v97,130.3 v97,124.2
  Bottom 1.3: v97,130.3 96.25,131.05 X16.1 | v97,124.2 F16.2
T3  (via drill 0.9)  (1 unrouted)
  Top 1.3: v90.9,130.3 v90.9,124.2
  Bottom 1.3: v90.9,130.3 90.9,131.1 89.25,132.75 X7.1 | F7.2 96.27,110.27 96.27,111.05 93.62,113.7 92.6,113.7 92.4,113.9 92.4,116.8 90.9,118.3 90.9,124.5
T4  (via drill 0.9 pad 0.95)
  Top 1.3: v124,130.3 v124,124.2
  Bottom 1.3: X18.1 124.25,130.55 v124,130.3 | F18.2 123,122.85 124,123.85 v124,124.2
T5  (via drill 0.9)
  Top 1.3: v118.3,130.3 v118.3,124.2
  Bottom 1.3: v118.3,130.3 118.3,136.95 X9.1 | F9.2 123.07,109.61 123.07,110.53 118.7,114.9 118.7,117.7 117.6,118.8 117.6,123.5 v118.3,124.2
T6  (via drill 0.9)
  Top 1.3: v110.3,130.3 v110.3,124.2
  Bottom 1.3: X17.1 110.3,146.95 v110.3,130.3 | F17.2 110,123.9 v110.3,124.2
T7  (via drill 0.9)  (1 unrouted)
  Top 1.3: v65.5,130.3 v65.5,124.2
  Bottom 1.3: v65.5,130.3 65.5,130.5 61.25,134.75 X5.1 | F5.2 70.82,109.72 70.82,112.08 65.4,117.5 65.4,124.3
T8  (via drill 0.9)
  Top 1.3: v58,130.3 v58,124.2
  Bottom 1.3: X13.1 54.25,134.05 v58,130.3 | v58,124.2 F13.2
T9  (via drill 0.9)  (1 unrouted)
  Top 1.3: v52.7,130.3 v52.7,124.2
  Bottom 1.3: v52.7,130.3 52.7,132.3 50,135 48,135 47.25,135.75 X4.1 | F4.2 58,111.8 54.5,115.3 54.3,115.3 52.6,117 52.6,124.2
T10  (via drill 0.9)  (1 unrouted)
  Top 1.3: v84,130.3 v84,124.2
  Bottom 1.3: v84,130.3 84,131.8 83.8,132 83,132 82.25,132.75 X15.1 | 84,124.1 F15.2
T11  (via drill 0.9)
  Top 1.3: v78.8,130.3 v78.8,124.2
  Bottom 1.3: v78.8,130.3 78.8,132 77,132 75.25,133.75 X6.1 | F6.2 84,110.42 80.4,114.03 80.4,116 78.8,117.6 v78.8,124.2
T12  (via drill 0.9)
  Top 1.3: v71,130.3 v71,124.2
  Bottom 1.3: v71,130.3 71,132 68.25,134.75 X14.1 | F14.2 v71,124.2 70.9,124.3
T13  (via drill 0.9)
  Top 1.3: v27.1,130.3 v27.1,124.2
  Bottom 1.3: v27.1,130.3 27.1,133.9 21.1,133.9 20.25,134.75 20.25,137 X2.1 | F2.2 32,112 31,113 28,113 27,114 27,124.1 v27.1,124.2
T14  (via drill 0.9)
  Top 1.3: v19,124.2 19,130.2 v18.9,130.3
  Bottom 1.3: v18.9,130.3 17.2,132 14,132 12.25,133.75 X10.1 | v19,124.2 F10.2
T15  (via drill 0.9)  (1 unrouted)
  Top 1.3: v12.5,130.3 v12.5,124.2
  Bottom 1.3: v12.5,130.3 8.7,130.3 5,134 5,137.75 X1.1 | F1.2 19,113.5 18.5,114 14.2,114 12.5,115.7 12.5,124
T16  (via drill 0.9)
  Top 1.3: v45,130.3 v45,124.2
  Bottom 1.3: v45,130.3 45,131 40.25,135.75 X12.1 | v45,124.2 F12.2
T17  (via drill 0.9)  (1 unrouted)
  Top 1.3: v39.75,130.3 39.8,130.25 v39.8,124.2
  Bottom 1.3: v39.75,130.3 39.35,130.7 39.35,131.27 34.62,136 34.25,136 33.25,137 X3.1 | F3.2 45,111.3 40,116.3 39.9,116.3 39.9,124
T18  (via drill 0.9)  (1 unrouted)
  Top 1.3: v32,130.3 v32,124.2
  Bottom 1.3: 32,124.3 v32,124.2 | v32,130.3 32,134.2 29.6,134.2 26.25,137.55 X11.1 | 32,124.1 F11.2
VIA4  (via drill 0.9)
  Top 0.305: v77.49,19.91 72.9,24.5 v72.9,24.81
  Bottom 0.508: IC1.26 112.32,35.79 112.32,19.21 102.74,19.21 102.04,19.91 v77.49,19.91 | U$1.D11 72.9,30.66 v72.9,24.81
VIA6  (via drill 0.6)  (1 unrouted)
  Top 0.305: v58.98,48.49 v58.98,42.14
  Bottom 0.305: 49.28,77.62 48.82,77.62
  Bottom 0.508: 49.28,77.62 50.99,75.91 50.99,64.63 R15.P$1 50.09,58.65 51.36,57.38 v58.98,48.49 | IC1.15 v58.98,42.14
VIAXX  (via drill 0.6)
  Top 0.3: v76.1,33.4 92,33.4 v92.2,33.6
  Bottom 0.3: 92.26,34.85 92.2,34.79 | v76.1,33.4 76.1,33.1
  Bottom 0.305: 75.49,31.31 U$1.D10
  Bottom 0.508: IC1.23 98.35,41.14 92.26,35.05 92.26,34.85 | IC2.23 54.87,35.79 51.76,32.68 51.76,13.53 64.66,13.53 75.49,24.36 U$1.D10 75.49,32.49 76.1,33.1 | 92.2,34.79 v92.2,33.6
(copper drawn outside any net)
  shapes: Top area x2